# Altium project İHA-PDU.PrjPcb (part 1 of 13)
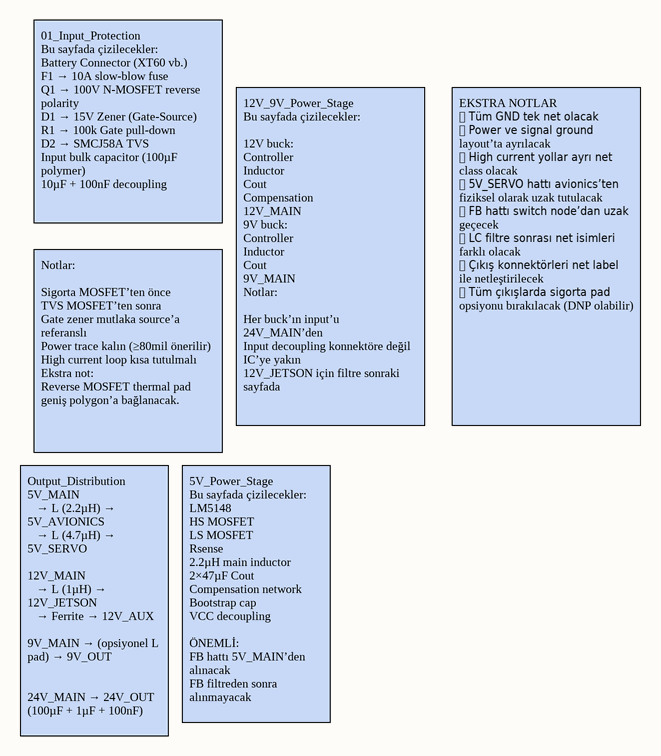
[diagram p0: PDU_Top_Level.SchDoc]
6 sheets, 163 parts. Net scope: global (net labels, ports and power ports of the same name join across sheets).
Board file: PDUNEW.PcbDoc
Sheets:
  PDU_Top_Level.SchDoc
  Input_Protection.SchDoc
  24V_Main_Regulator.SchDoc
  12V_9V_Power_Stage.SchDoc
  5V_Power_Stage.SchDoc
  Output_Distribution.SchDoc

## Sheet PDU_Top_Level.SchDoc
size 431 x 279 mm; Organization: ORGANIZATION; Address1: ADDRESS 1; Address2: ADDRESS 2; Address3: ADDRESS 3; Address4: ADDRESS 4; Revision: -; SheetNumber: 1; SheetTotal: 6; ENG_APP_DATE: --/--/--; DSN_APP_DATE: --/--/--; CHK_APP_DATE: --/--/--

### Notes on the sheet
- 01_Input_Protection
  Bu sayfada çizilecekler:
  Battery Connector (XT60 vb.)
  F1 → 10A slow-blow fuse
  Q1 → 100V N‑MOSFET reverse polarity
  D1 → 15V Zener (Gate‑Source)
  R1 → 100k Gate pull‑down
  D2 → SMCJ58A TVS
  Input bulk capacitor (100µF polymer)
  10µF + 100nF decoupling
- 12V_9V_Power_Stage
  Bu sayfada çizilecekler:
  12V buck:
  Controller
  Inductor
  Cout
  Compensation
  12V_MAIN
  9V buck:
  Controller
  Inductor
  Cout
  9V_MAIN
  Notlar:
  Her buck’ın input’u 24V_MAIN’den
  Input decoupling konnektöre değil IC’ye yakın
  12V_JETSON için filtre sonraki sayfada
- EKSTRA NOTLAR
  ✅ Tüm GND tek net olacak
  ✅ Power ve signal ground layout’ta ayrılacak
  ✅ High current yollar ayrı net class olacak
  ✅ 5V_SERVO hattı avionics’ten fiziksel olarak uzak tutulacak
  ✅ FB hattı switch node’dan uzak geçecek
  ✅ LC filtre sonrası net isimleri farklı olacak
  ✅ Çıkış konnektörleri net label ile netleştirilecek
  ✅ Tüm çıkışlarda sigorta pad opsiyonu bırakılacak (DNP olabilir)
- Notlar:
  Sigorta MOSFET’ten önce
  TVS MOSFET’ten sonra
  Gate zener mutlaka source’a referanslı
  Power trace kalın (≥80mil önerilir)
  High current loop kısa tutulmalı
  Ekstra not:
  Reverse MOSFET thermal pad geniş polygon’a bağlanacak.
- Output_Distribution
  5V_MAIN
  → L (2.2µH) → 5V_AVIONICS
  → L (4.7µH) → 5V_SERVO
  12V_MAIN
  → L (1µH) → 12V_JETSON
  → Ferrite → 12V_AUX
  9V_MAIN → (opsiyonel L pad) → 9V_OUT
  24V_MAIN → 24V_OUT
  (100µF + 1µF + 100nF)
- 5V_Power_Stage
  Bu sayfada çizilecekler:
  LM5148
  HS MOSFET
  LS MOSFET
  Rsense
  2.2µH main inductor
  2×47µF Cout
  Compensation network
  Bootstrap cap
  VCC decoupling
  ÖNEMLİ:
  FB hattı 5V_MAIN’den alınacak
  FB filtreden sonra alınmayacak
- DWG. NO.
- REV.
- SHT.
- THIS DOCUMENT AND THE DATA DISCLOSED HEREIN OR HEREWITH IS THE PROPERTY OF ALTIUM LIMITED AND MAY BE FREELY DISTRIBUTED IN WHOLE. NO RIGHTS ARE RESERVED OR EXPRESS OR IMPLIED WARANTEE GIVEN.
- REVISION
- DESCRIPTION
- DATE
- APPROVED
- ENG:
- APPROVALS
- PROJECT
- DSN:
- CHK:
- REFERENCE DOCUMENTS
- PROJECT REVISION:
- TITLE
- DOCUMENT REVISION:
- DESIGN ITEM:
- BOM:
- FAB DWG:
- PCB DWG:
- ASSY DWG:
- SCALE:
- SIZE
- B
- CAGE CODE
- FILE NAME
- DWG NO.
- SHEET
- OF
- REV

## Sheet Input_Protection.SchDoc
size 431 x 279 mm; Organization: ORGANIZATION; Address1: ADDRESS 1; Address2: ADDRESS 2; Address3: ADDRESS 3; Address4: ADDRESS 4; Revision: -; SheetNumber: 2; SheetTotal: 6; ENG_APP_DATE: --/--/--; DSN_APP_DATE: --/--/--; CHK_APP_DATE: --/--/--
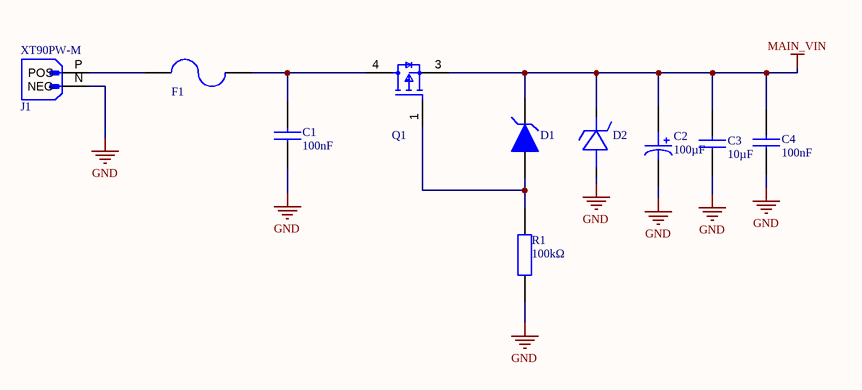
[diagram p1: Input_Protection.SchDoc]

### Parts
C1  value 100nF  [CAP_0603]  (hidden comment: CGA3E2X7R1H104K080AA)
C2  value 100µF  [CAP ALUM SMD]  (hidden comment: EEH-ZA1V101P)
C3  value 10µF  [CAP_1206]  (hidden comment: C3216X7R1H106K160AC)
C4  value 100nF  [CAP_0603]  (hidden comment: CGA3E2X7R1H104K080AA)
D1  BZT52C15  [SOD323]  (value not drawn)
D2  SMCJ58A  [SMC (DO-214AB)]  (value not drawn)
F1  Littelfuse 0452010.MRL  [FUSE_2410]  (value not drawn)
J1  XT90PW-M  [XT90PW-M]
Q1  SQM120P06-07L  [D2PAK]  (value not drawn)
R1  value 100kΩ  [RES_0603]  (hidden comment: CRCW0603100KFKEA)

### Nets
GND: C1.1 C2.2(A) C3.1 C4.1 D2.2 J1.N(NEG) R1.1
MAIN_VIN: C2.1(C) C3.2 C4.2 D1.1 D2.1 Q1.3(S)
NetC1_2: C1.2 F1.2 Q1.4(D)
NetD1_2: D1.2 Q1.1(G) R1.2
NetF1_1: F1.1 J1.P(POS)

### Notes on the sheet
- DWG. NO.
- REV.
- SHT.
- THIS DOCUMENT AND THE DATA DISCLOSED HEREIN OR HEREWITH IS THE PROPERTY OF ALTIUM LIMITED AND MAY BE FREELY DISTRIBUTED IN WHOLE. NO RIGHTS ARE RESERVED OR EXPRESS OR IMPLIED WARANTEE GIVEN.
- REVISION
- DESCRIPTION
- DATE
- APPROVED
- ENG:
- APPROVALS
- PROJECT
- DSN:
- CHK:
- REFERENCE DOCUMENTS
- PROJECT REVISION:
- TITLE
- DOCUMENT REVISION:
- DESIGN ITEM:
- BOM:
- FAB DWG:
- PCB DWG:
- ASSY DWG:
- SCALE:
- SIZE
- B
- CAGE CODE
- FILE NAME
- DWG NO.
- SHEET
- OF
- REV

### Library data of the parts
C1 C4 = CGA3E2X7R1H104K080AA: CGA Series 0603 100 nF 50 V ±10 % Tolerance X7R SMT Multilayer Ceramic Capacitor; Manufacturer: TDK; Manufacturer Lifecycle Status: PRODUCTION; Tolerance: 10%; Voltage: 50V; Supplier: Farnell; Supplier Part Number: CGA3E2X7R1H104K080AA; Manufacturer Part Number: CGA3E2X7R1H104K080AA; RoHS: Compliant; Category: Ceramic Capacitors; Stock: 155038; Pricing: 10=0,0336, 100=0,0286, 500=0,0215, 1000=0,0184, 2000=0,0173 (EUR); Case/Package: 0603; Case Code (Imperial): 0603; Case Code (Metric): 1608; China RoHS: Compliant; Composition: Ceramic; Depth: 800µm; Dielectric: X7R; Dielectric Material: Ceramic; Height: 800µm; Lead Free: Lead Free; Length: 1.6mm; Lifecycle Status: Production; Material: Ceramic; Max Length: 1.7mm; Max Operating Temperature: 125°C; Max Width: 900µm; Min Length: 1.5mm; Min Operating Temperature: -55°C; Min Width: 700µm; Mounting Technology: Surface Mount; Number of Terminals: 2; Radiation Hardening: No; Ratings: AEC-Q200; REACH SVHC: Yes; Schedule B: 8532240020, 8532240020|8532240020|8532240020|8532240020|8532240020; Termination: SMD/SMT; Thickness: 889µm; Voltage Rating: 50V; Voltage Rating (DC): 50V; Weight: 2.012816mg; Width: 800µm; ComponentLink1URL: https://datasheet.octopart.com:443/CGA3E2X7R1H104K080AA-TDK-datasheet-165583812.pdf?src-supplier=IHS; ComponentLink1Description: https://datasheet.octopart.com:443/CGA3E2X7R1H104K080AA-TDK-datasheet-165583812.pdf?src-supplier=IHS; ComponentLink2URL: https://datasheet.octopart.com:443/CGA3E2X7R1H104K080AA-TDK-datasheet-138890726.pdf?src-supplier=Upverter; ComponentLink2Description: https://datasheet.octopart.com:443/CGA3E2X7R1H104K080AA-TDK-datasheet-138890726.pdf?src-supplier=Upverter; ComponentLink3URL: https://datasheet.octopart.com:443/CGA3E2X7R1H104K080AA-TDK-datasheet-43457115.pdf?src-supplier=Upverter; ComponentLink3Description: https://datasheet.octopart.com:443/CGA3E2X7R1H104K080AA-TDK-datasheet-43457115.pdf?src-supplier=Upverter; ComponentLink4URL: https://datasheet.octopart.com:443/CGA3E2X7R1H104K080AA-TDK-datasheet-151546526.pdf?src-supplier=ODG+(Origin+Data+Global); ComponentLink4Description: https://datasheet.octopart.com:443/CGA3E2X7R1H104K080AA-TDK-datasheet-151546526.pdf?src-supplier=ODG+(Origin+Data+Global); ComponentLink5URL: https://datasheet.octopart.com:443/CGA3E2X7R1H104K080AA-TDK-datasheet-43366117.pdf?src-supplier=Newark; ComponentLink5Description: https://datasheet.octopart.com:443/CGA3E2X7R1H104K080AA-TDK-datasheet-43366117.pdf?src-supplier=Newark; ComponentLink6URL: https://datasheet.octopart.com:443/CGA3E2X7R1H104K080AA-TDK-datasheet-23766614.pdf?src-supplier=Newark; ComponentLink6Description: https://datasheet.octopart.com:443/CGA3E2X7R1H104K080AA-TDK-datasheet-23766614.pdf?src-supplier=Newark; ComponentLink7URL: https://datasheet.octopart.com:443/CGA3E2X7R1H104K080AA-TDK-datasheet-13444418.pdf?src-supplier=Newark; ComponentLink7Description: https://datasheet.octopart.com:443/CGA3E2X7R1H104K080AA-TDK-datasheet-13444418.pdf?src-supplier=Newark; ComponentLink8URL: https://datasheet.octopart.com:443/CGA3E2X7R1H104K080AA.-TDK-datasheet-159510193.pdf?src-supplier=Newark; ComponentLink8Description: https://datasheet.octopart.com:443/CGA3E2X7R1H104K080AA.-TDK-datasheet-159510193.pdf?src-supplier=Newark; ComponentLink9URL: https://datasheet.octopart.com:443/CGA3E2X7R1H104K080AA-TDK-datasheet-136412745.pdf?src-supplier=element14+APAC; ComponentLink9Description: https://datasheet.octopart.com:443/CGA3E2X7R1H104K080AA-TDK-datasheet-136412745.pdf?src-supplier=element14+APAC; ComponentLink10URL: https://datasheet.octopart.com:443/CGA3E2X7R1H104K080AA-TDK-datasheet-21217900.pdf?src-supplier=Farnell; ComponentLink10Description: https://datasheet.octopart.com:443/CGA3E2X7R1H104K080AA-TDK-datasheet-21217900.pdf?src-supplier=Farnell; ComponentLink11URL: https://datasheet.octopart.com:443/CGA3E2X7R1H104K080AA-TDK-datasheet-164882302.pdf?src-supplier=Burklin+Elektronik; ComponentLink11Description: https://datasheet.octopart.com:443/CGA3E2X7R1H104K080AA-TDK-datasheet-164882302.pdf?src-supplier=Burklin+Elektronik; ComponentLink12URL: https://datasheet.octopart.com:443/CGA3E2X7R1H104K080AA-TDK-datasheet-13234200.pdf?src-supplier=Future+Electronics; ComponentLink12Description: https://datasheet.octopart.com:443/CGA3E2X7R1H104K080AA-TDK-datasheet-13234200.pdf?src-supplier=Future+Electronics; ComponentLink13URL: https://datasheet.octopart.com:443/CGA3E2X7R1H104K080AA-TDK-datasheet-12527010.pdf?src-supplier=Future+Electronics; ComponentLink13Description: https://datasheet.octopart.com:443/CGA3E2X7R1H104K080AA-TDK-datasheet-12527010.pdf?src-supplier=Future+Electronics; ComponentLink14URL: https://datasheet.octopart.com:443/CGA3E2X7R1H104K080AA-TDK-datasheet-140571036.pdf?src-supplier=Arrow.cn; ComponentLink14Description: https://datasheet.octopart.com:443/CGA3E2X7R1H104K080AA-TDK-datasheet-140571036.pdf?src-supplier=Arrow.cn
C2 = EEH-ZA1V101P: Conductive Polymer Hybrid Aluminum Electrolytic Capacitors, 100µF, 35V, -55 to 105¡C; Manufacturer: Panasonic; Manufacturer Lifecycle Status: ACTIVE; Part Series: ZA (High temp. reflow); ESR (Equivalent Series Resistance): 27mΩ; Leakage Current: 35µA; Life (Hours): 10000hours; Ripple Current: 2.3A; Tolerance: 20%; Supplier: Future Electronics; Supplier Part Number: EEH-ZA1V101P; Manufacturer Part Number: EEH-ZA1V101P; RoHS: Compliant; Category: Polymer Capacitors; Stock: 1000; Pricing: 500=0,335, 1000=0,33, 1500=0,325, 5000=0,315 (USD); ComponentLink1URL: https://datasheet.octopart.com:443/EEH-ZA1V101P-Panasonic-datasheet-136612405.pdf?src-supplier=Electro+Sonic; ComponentLink1Description: https://datasheet.octopart.com:443/EEH-ZA1V101P-Panasonic-datasheet-136612405.pdf?src-supplier=Electro+Sonic; ComponentLink2URL: https://datasheet.octopart.com:443/EEH-ZA1V101P-Panasonic-datasheet-154840537.pdf?src-supplier=Electro+Sonic; ComponentLink2Description: https://datasheet.octopart.com:443/EEH-ZA1V101P-Panasonic-datasheet-154840537.pdf?src-supplier=Electro+Sonic; ComponentLink3URL: https://datasheet.octopart.com:443/EEH-ZA1V101P-Panasonic-datasheet-68301292.pdf?src-supplier=Future+Electronics; ComponentLink3Description: https://datasheet.octopart.com:443/EEH-ZA1V101P-Panasonic-datasheet-68301292.pdf?src-supplier=Future+Electronics; Case/Package: 3333; Country of Origin: Japan; Diameter: 8mm; Export Control Classification Number (ECCN) Code: EAR99; Height: 10.2mm; Harmonized Tariff Schedule (HTS) Code: 8532.22.00.20; Introduction Date: 2019-05-31; Length: 10.2mm; Lifecycle Status: Production; Material: Polymer; Max Operating Temperature: 105°C; Min Operating Temperature: -55°C; Mounting Technology: Surface Mount; Number of Terminals: 2; Ratings: AEC-Q200; REACH SVHC: Yes; Voltage Rating: 35V; Voltage Rating (DC): 35V; Width: 8.3mm; ComponentLink4URL: https://datasheet.octopart.com:443/EEHZA1V101P-Panasonic-datasheet-68301292.pdf?src-supplier=Panasonic; ComponentLink4Description: https://datasheet.octopart.com:443/EEHZA1V101P-Panasonic-datasheet-68301292.pdf?src-supplier=Panasonic; ComponentLink5URL: https://datasheet.octopart.com:443/EEHZA1V101P-Panasonic-datasheet-137675046.pdf?src-supplier=TME; ComponentLink5Description: https://datasheet.octopart.com:443/EEHZA1V101P-Panasonic-datasheet-137675046.pdf?src-supplier=TME
C3 = C3216X7R1H106K160AC: 50V 10uF X7R 卤10% 1206 Multilayer Ceramic Capacitors MLCC - SMD/SMT ROHS; Manufacturer: TDK; Manufacturer Lifecycle Status: PRODUCTION; Supplier: Farnell; Supplier Part Number: C3216X7R1H106K160AC; Manufacturer Part Number: C3216X7R1H106K160AC; RoHS: Compliant; Category: Ceramic Capacitors; Stock: 6363; Pricing: 5=0,77, 50=0,378, 250=0,344, 500=0,286, 1000=0,268, 2000=0,259 (EUR); Case/Package: 1206; Case Code (Metric): 3216; China RoHS: Compliant; Dielectric: X7R; Dielectric Material: Ceramic; Export Control Classification Number (ECCN) Code: EAR99; Height: 1.6mm; Harmonized Tariff Schedule (HTS) Code: 8532.24.00.20; Introduction Date: 2018-03-29; Lead Free: Lead Free; Length: 3.2mm; Lifecycle Status: Production; Material: Ceramic; Max Length: 3.5mm; Max Operating Temperature: 125°C; Max Width: 1.9mm; Min Length: 3.1mm; Min Operating Temperature: -55°C; Min Width: 1.5mm; Mounting Technology: Surface Mount; Number of Terminals: 2; REACH SVHC: Yes; Schedule B: 8532240020, 8532240020|8532240020|8532240020|8532240020|8532240020; Thickness: 1.6mm; Voltage Rating: 50V; Voltage Rating (DC): 50V; Width: 1.6mm; ComponentLink1URL: https://datasheet.octopart.com:443/C3216X7R1H106K160AC-TDK-datasheet-175423548.pdf?src-supplier=TME; ComponentLink1Description: https://datasheet.octopart.com:443/C3216X7R1H106K160AC-TDK-datasheet-175423548.pdf?src-supplier=TME; ComponentLink2URL: https://datasheet.octopart.com:443/C3216X7R1H106K160AC-TDK-datasheet-182135025.pdf?src-supplier=TME; ComponentLink2Description: https://datasheet.octopart.com:443/C3216X7R1H106K160AC-TDK-datasheet-182135025.pdf?src-supplier=TME; ComponentLink3URL: https://datasheet.octopart.com:443/C3216X7R1H106K160AC-TDK-datasheet-159617022.pdf?src-supplier=TME; ComponentLink3Description: https://datasheet.octopart.com:443/C3216X7R1H106K160AC-TDK-datasheet-159617022.pdf?src-supplier=TME; ComponentLink4URL: https://datasheet.octopart.com:443/C3216X7R1H106K160AC-TDK-datasheet-151546523.pdf?src-supplier=ODG+(Origin+Data+Global); ComponentLink4Description: https://datasheet.octopart.com:443/C3216X7R1H106K160AC-TDK-datasheet-151546523.pdf?src-supplier=ODG+(Origin+Data+Global); ComponentLink5URL: https://datasheet.octopart.com/C3216X7R1H106K160AC-TDK-datasheet-41194876.pdf; ComponentLink5Description: https://datasheet.octopart.com/C3216X7R1H106K160AC-TDK-datasheet-41194876.pdf; ComponentLink6URL: https://datasheet.octopart.com/C-Series-Ceramic-Chip-Capacitors-TDK-datasheet-family-84.pdf; ComponentLink6Description: https://datasheet.octopart.com/C-Series-Ceramic-Chip-Capacitors-TDK-datasheet-family-84.pdf; ComponentLink7URL: http://sigma.octopart.com:80/rohs_certificate/C-Series-Ceramic-Chip-Capacitors-TDK-family-108.pdf?src-supplier=Compliance+Statements; ComponentLink7Description: http://sigma.octopart.com:80/rohs_certificate/C-Series-Ceramic-Chip-Capacitors-TDK-family-108.pdf?src-supplier=Compliance+Statements
D1 = BZT52C15: BZT52C15S Series 200 mW 15 V 10 mA Surface Mount Zener Diode - SOD-323; Manufacturer: Diodes Inc.; Manufacturer Part Number: BZT52C15S-7-F; Element Configuration: Single; ESD Protection: No; Forward Current: 10mA; Forward Voltage: 900mV; Impedance: 30Ω; Max Junction Temperature (Tj): 150°C; Max Power Dissipation: 200mW; Max Reverse Leakage Current: 100nA; Number of Elements: 1; Output Current: 50mA; Polarity: Unidirectional; Reference Voltage: 15V; Reverse Voltage: 10.5V; Test Current: 5mA; Tolerance: 6%; Voltage Tolerance: 6.12%; Supplier: Arrow Electronics; Supplier Part Number: BZT52C15S-7-F; RoHS: Compliant; Category: Zener Diodes; Stock: 448; Pricing: 448=0,0267 (USD); China RoHS: Compliant; Composition: Zener; Contact Plating: Tin; Country of Origin: Mainland China, Taiwan; Export Control Classification Number (ECCN) Code: EAR99; Height: 1.2mm; Harmonized Tariff Schedule (HTS) Code: 8541.10.00.50; Introduction Date: 2002-09-04; Lead Free: Lead Free; Length: 1.8mm; Lifecycle Status: Production; Max Operating Temperature: 150°C; Min Operating Temperature: -65°C; Mounting Technology: Surface Mount; Pins: 2; Number of Terminals: 2; Packaging: Cut Tape; Peak Reverse Current: 100nA; Power Dissipation: 200mW; Power Rating: 200mW; Radiation Hardening: No; REACH SVHC: Yes; Schedule B: 8541100050, 8541100050|8541100050|8541100050|8541100050|8541100050; Termination: SMD/SMT; Voltage Rating (DC): 15V; Weight: 4.904468mg; Width: 1.4mm; Working Voltage: 15V; Zener Current: 5mA; Zener Voltage: 15V; ComponentLink1URL: https://sigma.octopart.com:443/138810740/technical_drawing/Diodes-Inc.-BZT52C15S-7-F.pdf?src-supplier=Diodes+Inc+SCT; ComponentLink1Description: https://sigma.octopart.com:443/138810740/technical_drawing/Diodes-Inc.-BZT52C15S-7-F.pdf?src-supplier=Diodes+Inc+SCT; ComponentLink2URL: https://datasheet.octopart.com:443/BZT52C15S-7-F-Diodes-Inc.-datasheet-101585694.pdf?src-supplier=element14+APAC; ComponentLink2Description: https://datasheet.octopart.com:443/BZT52C15S-7-F-Diodes-Inc.-datasheet-101585694.pdf?src-supplier=element14+APAC; ComponentLink3URL: https://datasheet.octopart.com:443/BZT52C15S-7-F-Diodes-Inc.-datasheet-11024782.pdf?src-supplier=RS+(Formerly+Allied+Electronics); ComponentLink3Description: https://datasheet.octopart.com:443/BZT52C15S-7-F-Diodes-Inc.-datasheet-11024782.pdf?src-supplier=RS+(Formerly+Allied+Electronics); ComponentLink4URL: https://datasheet.octopart.com/BZT52C15S-7-F-Diodes-Inc.-datasheet-10841798.pdf; ComponentLink4Description: https://datasheet.octopart.com/BZT52C15S-7-F-Diodes-Inc.-datasheet-10841798.pdf; ComponentLink5URL: https://datasheet.octopart.com/BZT52C15S-7-F-Diodes-Inc.-datasheet-5391111.pdf; ComponentLink5Description: https://datasheet.octopart.com/BZT52C15S-7-F-Diodes-Inc.-datasheet-5391111.pdf; ComponentLink6URL: https://datasheet.octopart.com:443/BZT52C15S-7-F-Diodes-Inc.-datasheet-101585693.pdf?src-supplier=Future+Electronics; ComponentLink6Description: https://datasheet.octopart.com:443/BZT52C15S-7-F-Diodes-Inc.-datasheet-101585693.pdf?src-supplier=Future+Electronics; ComponentLink7URL: https://datasheet.octopart.com:443/BZT52C15S-7-F-Diodes-Inc.-datasheet-12513818.pdf?src-supplier=Future+Electronics; ComponentLink7Description: https://datasheet.octopart.com:443/BZT52C15S-7-F-Diodes-Inc.-datasheet-12513818.pdf?src-supplier=Future+Electronics; ComponentLink8URL: https://datasheet.octopart.com:443/BZT52C15S-7-F-Diodes-Inc.-datasheet-10941054.pdf?src-supplier=Future+Electronics; ComponentLink8Description: https://datasheet.octopart.com:443/BZT52C15S-7-F-Diodes-Inc.-datasheet-10941054.pdf?src-supplier=Future+Electronics; ComponentLink9URL: https://datasheet.octopart.com:443/BZT52C15S-7-F-Diodes-Inc.-datasheet-10839781.pdf?src-supplier=Future+Electronics; ComponentLink9Description: https://datasheet.octopart.com:443/BZT52C15S-7-F-Diodes-Inc.-datasheet-10839781.pdf?src-supplier=Future+Electronics; ComponentLink10URL: https://datasheet.octopart.com:443/BZT52C15S-7-F-Diodes-Inc.-datasheet-10405015.pdf?src-supplier=Future+Electronics; ComponentLink10Description: https://datasheet.octopart.com:443/BZT52C15S-7-F-Diodes-Inc.-datasheet-10405015.pdf?src-supplier=Future+Electronics; ComponentLink11URL: https://datasheet.octopart.com:443/BZT52C15S-7-F-Diodes-Inc.-datasheet-5318325.pdf?src-supplier=Future+Electronics; ComponentLink11Description: https://datasheet.octopart.com:443/BZT52C15S-7-F-Diodes-Inc.-datasheet-5318325.pdf?src-supplier=Future+Electronics; ComponentLink12URL: https://datasheet.octopart.com:443/BZT52C15S-7-F-Diodes-Inc.-datasheet-14050910.pdf?src-supplier=iiiC; ComponentLink12Description: https://datasheet.octopart.com:443/BZT52C15S-7-F-Diodes-Inc.-datasheet-14050910.pdf?src-supplier=iiiC; ComponentLink13URL: https://datasheet.octopart.com:443/BZT52C15S-7-F-Diodes-Inc.-datasheet-120913.pdf?src-supplier=DigiKey; ComponentLink13Description: https://datasheet.octopart.com:443/BZT52C15S-7-F-Diodes-Inc.-datasheet-120913.pdf?src-supplier=DigiKey; ComponentLink14URL: https://datasheet.octopart.com:443/BZT52C15S-7-F-Diodes-Inc.-datasheet-1309.pdf?src-supplier=Mouser; ComponentLink14Description: https://datasheet.octopart.com:443/BZT52C15S-7-F-Diodes-Inc.-datasheet-1309.pdf?src-supplier=Mouser; ComponentLink15URL: http://sigma.octopart.com:80/15616907/materials_sheet/Diodes-Inc.-BZT52C15S-7-F.pdf?src-supplier=Compliance+Statements; ComponentLink15Description: http://sigma.octopart.com:80/15616907/materials_sheet/Diodes-Inc.-BZT52C15S-7-F.pdf?src-supplier=Compliance+Statements
D2 = SMCJ58A: Diode TVS Single Uni-Directional 58V 1.5kW 2-Pin DO-214AB; Manufacturer: Taiwan Semiconductor; Manufacturer Lifecycle Status: ACTIVE; Breakdown Voltage: 67.8V; Clamping Voltage: 93.6V; Forward Voltage: 1V; Max Breakdown Voltage: 71.2V; Max Forward Surge Current (Ifsm): 2.5A; Max Junction Temperature (Tj): 150°C; Max Power Dissipation: 5W; Max Repetitive Reverse Voltage (Vrrm): 250V; Max Reverse Leakage Current: 1µA; Max Surge Current: 200A; Min Breakdown Voltage: 64.4V; Number of Channels: 1; Peak Pulse Current: 16A; Polarity: Unidirectional; Power Dissipation: 200mW; Reverse Recovery Time: 50ns; Supplier: Farnell; Supplier Part Number: SMCJ58A; Manufacturer Part Number: SMCJ58A; RoHS: Compliant; Category: TVS Diodes; Stock: 274; Pricing: 1=0,594, 10=0,49, 100=0,342, 500=0,331, 1000=0,32, 5000=0,309 (EUR); China RoHS: Non-Compliant; Country of Origin: Mainland China, Taiwan; Export Control Classification Number (ECCN) Code: EAR99; Height: 2.62mm; Harmonized Tariff Schedule (HTS) Code: 8541.10.00.50; Introduction Date: 1998-01-21; Lead Free: Lead Free; Length: 7.11mm; Lifecycle Status: Production; Max Operating Temperature: 150°C; Min Operating Temperature: -55°C; Number of Elements: 1; Pins: 2; Number of Terminals: 2; Operating Supply Voltage: 58V; Peak Pulse Power: 1.5kW; Power Rating: 1.5kW; REACH SVHC: No; Reverse Standoff Voltage: 58V; Schedule B: 8541100080; Voltage Rating (DC): 58V; Width: 6.22mm; ComponentLink1URL: https://datasheet.octopart.com:443/SMCJ58A-Taiwan-Semiconductor-datasheet-151942226.pdf?src-supplier=TME; ComponentLink1Description: https://datasheet.octopart.com:443/SMCJ58A-Taiwan-Semiconductor-datasheet-151942226.pdf?src-supplier=TME; ComponentLink2URL: https://datasheet.octopart.com:443/SMCJ58A-Taiwan-Semiconductor-datasheet-181551142.pdf?src-supplier=IHS; ComponentLink2Description: https://datasheet.octopart.com:443/SMCJ58A-Taiwan-Semiconductor-datasheet-181551142.pdf?src-supplier=IHS; ComponentLink3URL: https://datasheet.octopart.com:443/SMCJ58A-Taiwan-Semiconductor-datasheet-182396156.pdf?src-supplier=IHS; ComponentLink3Description: https://datasheet.octopart.com:443/SMCJ58A-Taiwan-Semiconductor-datasheet-182396156.pdf?src-supplier=IHS; ComponentLink4URL: https://datasheet.octopart.com:443/SMCJ58A-Taiwan-Semiconductor-datasheet-180789152.pdf?src-supplier=IHS; ComponentLink4Description: https://datasheet.octopart.com:443/SMCJ58A-Taiwan-Semiconductor-datasheet-180789152.pdf?src-supplier=IHS; ComponentLink5URL: https://datasheet.octopart.com:443/SMCJ58A-Taiwan-Semiconductor-datasheet-137249697.pdf?src-supplier=Taiwan+Semiconductor; ComponentLink5Description: https://datasheet.octopart.com:443/SMCJ58A-Taiwan-Semiconductor-datasheet-137249697.pdf?src-supplier=Taiwan+Semiconductor; ComponentLink6URL: https://datasheet.octopart.com:443/SMCJ58A-Taiwan-Semiconductor-datasheet-34355355.pdf?src-supplier=Taiwan+Semiconductor; ComponentLink6Description: https://datasheet.octopart.com:443/SMCJ58A-Taiwan-Semiconductor-datasheet-34355355.pdf?src-supplier=Taiwan+Semiconductor; ComponentLink7URL: https://datasheet.octopart.com:443/SMCJ58A-Taiwan-Semiconductor-datasheet-65933527.pdf?src-supplier=Future+Electronics; ComponentLink7Description: https://datasheet.octopart.com:443/SMCJ58A-Taiwan-Semiconductor-datasheet-65933527.pdf?src-supplier=Future+Electronics
F1 = Littelfuse 0452010.MRL: Electric Fuse, Time Lag Blow, 10A, 72VAC, 60VDC, 50A (IR), Surface Mount, NANO; Ratings: CE, CSA, TUV; Time to Trip: 2ms; Voltage Rating (AC): 72V; Voltage Rating (DC): 60V; Supplier: Farnell; Supplier Part Number: 0452010.MRL; Manufacturer: Littelfuse; Manufacturer Part Number: 0452010.MRL; RoHS: Compliant; Category: Fuses; Stock: 195; Pricing: 1=3,24, 50=2,06, 100=1,9, 250=1,71, 500=1,57, 1000=1,46 (EUR); Current Rating: 10A; Export Control Classification Number (ECCN) Code: EAR99; Height: 2.69mm; Harmonized Tariff Schedule (HTS) Code: 8536.10.00.40; Introduction Date: 2024-06-26; Length: 6.1mm; Lifecycle Status: Production; Max Operating Temperature: 125°C; Min Operating Temperature: -55°C; Mounting Technology: Surface Mount; REACH SVHC: No; ComponentLink1URL: https://datasheet.octopart.com:443/0452010.MRL-Littelfuse-datasheet-183575671.pdf?src-supplier=Sager+Electronics; ComponentLink1Description: https://datasheet.octopart.com:443/0452010.MRL-Littelfuse-datasheet-183575671.pdf?src-supplier=Sager+Electronics
J1 = XT90PW-M: Socket; DC supply; XT90; male; PIN: 2; on PCBs; THT; Colour: yellow; Manufacturer: Amass; Category: Uncategorized; Color: Yellow; Contact Material: Brass; Manufacturer Part Number: XT90PW-M; Pins: 2; Orientation: Straight
Q1 = SQM120P06-07L: MOSFET P-CH 60V 120A TO263 / Trans MOSFET P-CH 60V 120A Automotive 3-Pin(2+Tab) D2PAK; Manufacturer: Vishay; Manufacturer Part Number: SQM120P06-07L_GE3; Drain to Source Breakdown Voltage: -60V; Drain to Source Resistance: 6.7mΩ; Element Configuration: Single; Fall Time: 32ns; Gate to Source Voltage (Vgs): 20V; Input Capacitance: 14.28nF; Max Junction Temperature (Tj): 175°C; Max Power Dissipation: 375W; Number of Channels: 1; Rise Time: 23ns; Threshold Voltage: -2V; Turn-Off Delay Time: 97ns; Turn-On Delay Time: 15ns; Supplier: Farnell; Supplier Part Number: SQM120P06-07L_GE3; RoHS: Compliant; Category: MOSFETs; Stock: 2376; Pricing: 1=4,9, 10=3,2, 100=2,51, 500=2,1, 1000=2,06 (EUR); Case/Package: TO-263; Continuous Drain Current (ID): 120A; Drain to Source Voltage (Vdss): -60V; Export Control Classification Number (ECCN) Code: EAR99; Height: 5.08mm; Introduction Date: 2010-09-09; Lead Free: Lead Free; Lifecycle Status: Production; Max Operating Temperature: 175°C; Min Breakdown Voltage: 60V; Min Operating Temperature: -55°C; Mounting Technology: Surface Mount; Number of Elements: 1; Pins: 3; Number of Terminals: 2; Packaging: Tape & Reel; Power Dissipation: 375W; Radiation Hardening: No; Rds On Max: 6.7mΩ; REACH SVHC: No; Schedule B: 8541290080, 8541290080|8541290080|8541290080|8541290080|8541290080; Weight: 1.946308g; ComponentLink1URL: https://datasheet.octopart.com:443/SQM120P06-07L_GE3-Vishay-datasheet-181368167.pdf?src-supplier=IHS; ComponentLink1Description: https://datasheet.octopart.com:443/SQM120P06-07L_GE3-Vishay-datasheet-181368167.pdf?src-supplier=IHS; ComponentLink2URL: https://datasheet.octopart.com:443/SQM120P06-07L_GE3-Vishay-datasheet-58971610.pdf?src-supplier=Upverter; ComponentLink2Description: https://datasheet.octopart.com:443/SQM120P06-07L_GE3-Vishay-datasheet-58971610.pdf?src-supplier=Upverter; ComponentLink3URL: https://datasheet.octopart.com:443/SQM120P06-07L_GE3-Vishay-datasheet-66078331.pdf?src-supplier=Newark; ComponentLink3Description: https://datasheet.octopart.com:443/SQM120P06-07L_GE3-Vishay-datasheet-66078331.pdf?src-supplier=Newark; ComponentLink4URL: https://datasheet.octopart.com:443/SQM120P06-07L_GE3-Vishay-datasheet-182431440.pdf?src-supplier=Future+Electronics; ComponentLink4Description: https://datasheet.octopart.com:443/SQM120P06-07L_GE3-Vishay-datasheet-182431440.pdf?src-supplier=Future+Electronics; ComponentLink5URL: http://sigma.octopart.com:80/rohs_statement/Vishay-company-15.pdf?src-supplier=Compliance+Statements; ComponentLink5Description: http://sigma.octopart.com:80/rohs_statement/Vishay-company-15.pdf?src-supplier=Compliance+Statements
R1 = CRCW0603100KFKEA: Res Thick Film 0603 100K Ohm 1% 1/3W ±100ppm/°C Molded SMD SMD Paper T/R; Manufacturer: Vishay; Manufacturer Part Number: CRCW0603100KFKEAHP; Max Power Dissipation: 250mW; Power Rating: 330mW; Voltage Rating: 75V; Supplier: Farnell; Supplier Part Number: CRCW0603100KFKEAHP; RoHS: Compliant; Category: Chip SMD Resistors; Stock: 78590; Pricing: 10=0,0404, 100=0,0303, 500=0,0261, 1000=0,0239, 2500=0,0223, 5000=0,0219 (EUR); Case/Package: 0603; Case Code (Imperial): 0603; Case Code (Metric): 1608; China RoHS: Non-Compliant; Composition: Thick Film; Contact Plating: Tin; Country of Origin: Israel; Depth: 850µm; Export Control Classification Number (ECCN) Code: EAR99; Features: Automotive AEC-Q200; Height: 450µm; Harmonized Tariff Schedule (HTS) Code: 8533.21.00.30; Introduction Date: 2008-07-29; Lead Free: Lead Free; Length: 1.6mm; Lifecycle Status: Production; Max Operating Temperature: 155°C; Military Standard: Not; Min Operating Temperature: -55°C; Mounting Technology: Surface Mount; Pins: 2; Number of Terminals: 2; Number of Terminations: 2; Packaging: Cut Tape; Radiation Hardening: No; Ratings: AEC-Q200; REACH SVHC: Yes; Schedule B: 8533210045, 8533210045|8533210045|8533210045|8533210045|8533210045; Temperature Coefficient: 100ppm/°C; Termination: SMD/SMT; Tolerance: 1%; Voltage Rating (DC): 75V; Weight: 2.012816mg; Width: 850µm; Working Voltage: 75V; ComponentLink1URL: https://datasheet.octopart.com:443/CRCW0603100KFKEAHP-Vishay-datasheet-13148866.pdf?src-supplier=Future+Electronics; ComponentLink1Description: https://datasheet.octopart.com:443/CRCW0603100KFKEAHP-Vishay-datasheet-13148866.pdf?src-supplier=Future+Electronics; ComponentLink2URL: https://datasheet.octopart.com:443/CRCW0603100KFKEAHP-Vishay-datasheet-13131392.pdf?src-supplier=Future+Electronics; ComponentLink2Description: https://datasheet.octopart.com:443/CRCW0603100KFKEAHP-Vishay-datasheet-13131392.pdf?src-supplier=Future+Electronics; ComponentLink3URL: https://datasheet.octopart.com:443/CRCW0603100KFKEAHP-Vishay-datasheet-12593106.pdf?src-supplier=Future+Electronics; ComponentLink3Description: https://datasheet.octopart.com:443/CRCW0603100KFKEAHP-Vishay-datasheet-12593106.pdf?src-supplier=Future+Electronics; ComponentLink4URL: https://datasheet.octopart.com:443/CRCW0603100KFKEAHP-Vishay-datasheet-12531795.pdf?src-supplier=Future+Electronics; ComponentLink4Description: https://datasheet.octopart.com:443/CRCW0603100KFKEAHP-Vishay-datasheet-12531795.pdf?src-supplier=Future+Electronics; ComponentLink5URL: https://datasheet.octopart.com:443/CRCW0603100KFKEAHP-Vishay-datasheet-12518686.pdf?src-supplier=Future+Electronics; ComponentLink5Description: https://datasheet.octopart.com:443/CRCW0603100KFKEAHP-Vishay-datasheet-12518686.pdf?src-supplier=Future+Electronics; ComponentLink6URL: https://datasheet.octopart.com:443/CRCW0603100KFKEAHP-Vishay-datasheet-12509906.pdf?src-supplier=Future+Electronics; ComponentLink6Description: https://datasheet.octopart.com:443/CRCW0603100KFKEAHP-Vishay-datasheet-12509906.pdf?src-supplier=Future+Electronics; ComponentLink7URL: https://datasheet.octopart.com:443/CRCW0603100KFKEAHP-Vishay-datasheet-10669844.pdf?src-supplier=Future+Electronics; ComponentLink7Description: https://datasheet.octopart.com:443/CRCW0603100KFKEAHP-Vishay-datasheet-10669844.pdf?src-supplier=Future+Electronics; ComponentLink8URL: https://datasheet.octopart.com:443/CRCW0603100KFKEAHP-Vishay-datasheet-8703221.pdf?src-supplier=Future+Electronics; ComponentLink8Description: https://datasheet.octopart.com:443/CRCW0603100KFKEAHP-Vishay-datasheet-8703221.pdf?src-supplier=Future+Electronics; ComponentLink9URL: https://datasheet.octopart.com:443/CRCW0603100KFKEAHP-Vishay-datasheet-62316122.pdf?src-supplier=Future+Electronics; ComponentLink9Description: https://datasheet.octopart.com:443/CRCW0603100KFKEAHP-Vishay-datasheet-62316122.pdf?src-supplier=Future+Electronics; ComponentLink10URL: https://datasheet.octopart.com:443/CRCW0603100KFKEAHP-Vishay-datasheet-12544674.pdf?src-supplier=_legacy+Avnet; ComponentLink10Description: https://datasheet.octopart.com:443/CRCW0603100KFKEAHP-Vishay-datasheet-12544674.pdf?src-supplier=_legacy+Avnet; ComponentLink11URL: https://datasheet.octopart.com:443/CRCW0603100KFKEAHP-Vishay-datasheet-87136057.pdf?src-supplier=Newark; ComponentLink11Description: https://datasheet.octopart.com:443/CRCW0603100KFKEAHP-Vishay-datasheet-87136057.pdf?src-supplier=Newark; ComponentLink12URL: https://datasheet.octopart.com:443/CRCW0603100KFKEAHP-Vishay-datasheet-66581887.pdf?src-supplier=Newark; ComponentLink12Description: https://datasheet.octopart.com:443/CRCW0603100KFKEAHP-Vishay-datasheet-66581887.pdf?src-supplier=Newark; ComponentLink13URL: https://datasheet.octopart.com:443/CRCW0603100KFKEAHP-Vishay-datasheet-37143532.pdf?src-supplier=Newark; ComponentLink13Description: https://datasheet.octopart.com:443/CRCW0603100KFKEAHP-Vishay-datasheet-37143532.pdf?src-supplier=Newark; ComponentLink14URL: https://datasheet.octopart.com:443/CRCW0603100KFKEAHP-Vishay-datasheet-8359436.pdf?src-supplier=Newark; ComponentLink14Description: https://datasheet.octopart.com:443/CRCW0603100KFKEAHP-Vishay-datasheet-8359436.pdf?src-supplier=Newark; ComponentLink15URL: https://datasheet.octopart.com:443/CRCW0603100KFKEAHP-Vishay-datasheet-112276998.pdf?src-supplier=Newark; ComponentLink15Description: https://datasheet.octopart.com:443/CRCW0603100KFKEAHP-Vishay-datasheet-112276998.pdf?src-supplier=Newark; ComponentLink16URL: https://datasheet.octopart.com:443/CRCW0603100KFKEAHP-Vishay-datasheet-62317933.pdf?src-supplier=element14+APAC; ComponentLink16Description: https://datasheet.octopart.com:443/CRCW0603100KFKEAHP-Vishay-datasheet-62317933.pdf?src-supplier=element14+APAC; ComponentLink17URL: https://datasheet.octopart.com/CRCW0603100KFKEAHP-Vishay-datasheet-83567917.pdf; ComponentLink17Description: https://datasheet.octopart.com/CRCW0603100KFKEAHP-Vishay-datasheet-83567917.pdf; ComponentLink18URL: https://datasheet.octopart.com/D-CRCW-e3-Standard-Thick-Film-Chip-Resistors-Vishay-datasheet-family-64.pdf; ComponentLink18Description: https://datasheet.octopart.com/D-CRCW-e3-Standard-Thick-Film-Chip-Resistors-Vishay-datasheet-family-64.pdf; ComponentLink19URL: https://datasheet.octopart.com:443/CRCW0603100KFKEAHP-Vishay-Dale-datasheet-47688881.pdf?src-supplier=RS+(Formerly+Allied+Electronics); ComponentLink19Description: https://datasheet.octopart.com:443/CRCW0603100KFKEAHP-Vishay-Dale-datasheet-47688881.pdf?src-supplier=RS+(Formerly+Allied+Electronics); ComponentLink20URL: http://sigma.octopart.com:80/rohs_certificate/D-CRCW-e3-Standard-Thick-Film-Chip-Resistors-Vishay-family-102.pdf?src-supplier=Compliance+Statements; ComponentLink20Description: http://sigma.octopart.com:80/rohs_certificate/D-CRCW-e3-Standard-Thick-Film-Chip-Resistors-Vishay-family-102.pdf?src-supplier=Compliance+Statements

## Sheet 24V_Main_Regulator.SchDoc
size 431 x 279 mm; Organization: ORGANIZATION; Address1: ADDRESS 1; Address2: ADDRESS 2; Address3: ADDRESS 3; Address4: ADDRESS 4; Revision: -; SheetNumber: 3; SheetTotal: 6; ENG_APP_DATE: --/--/--; DSN_APP_DATE: --/--/--; CHK_APP_DATE: --/--/--
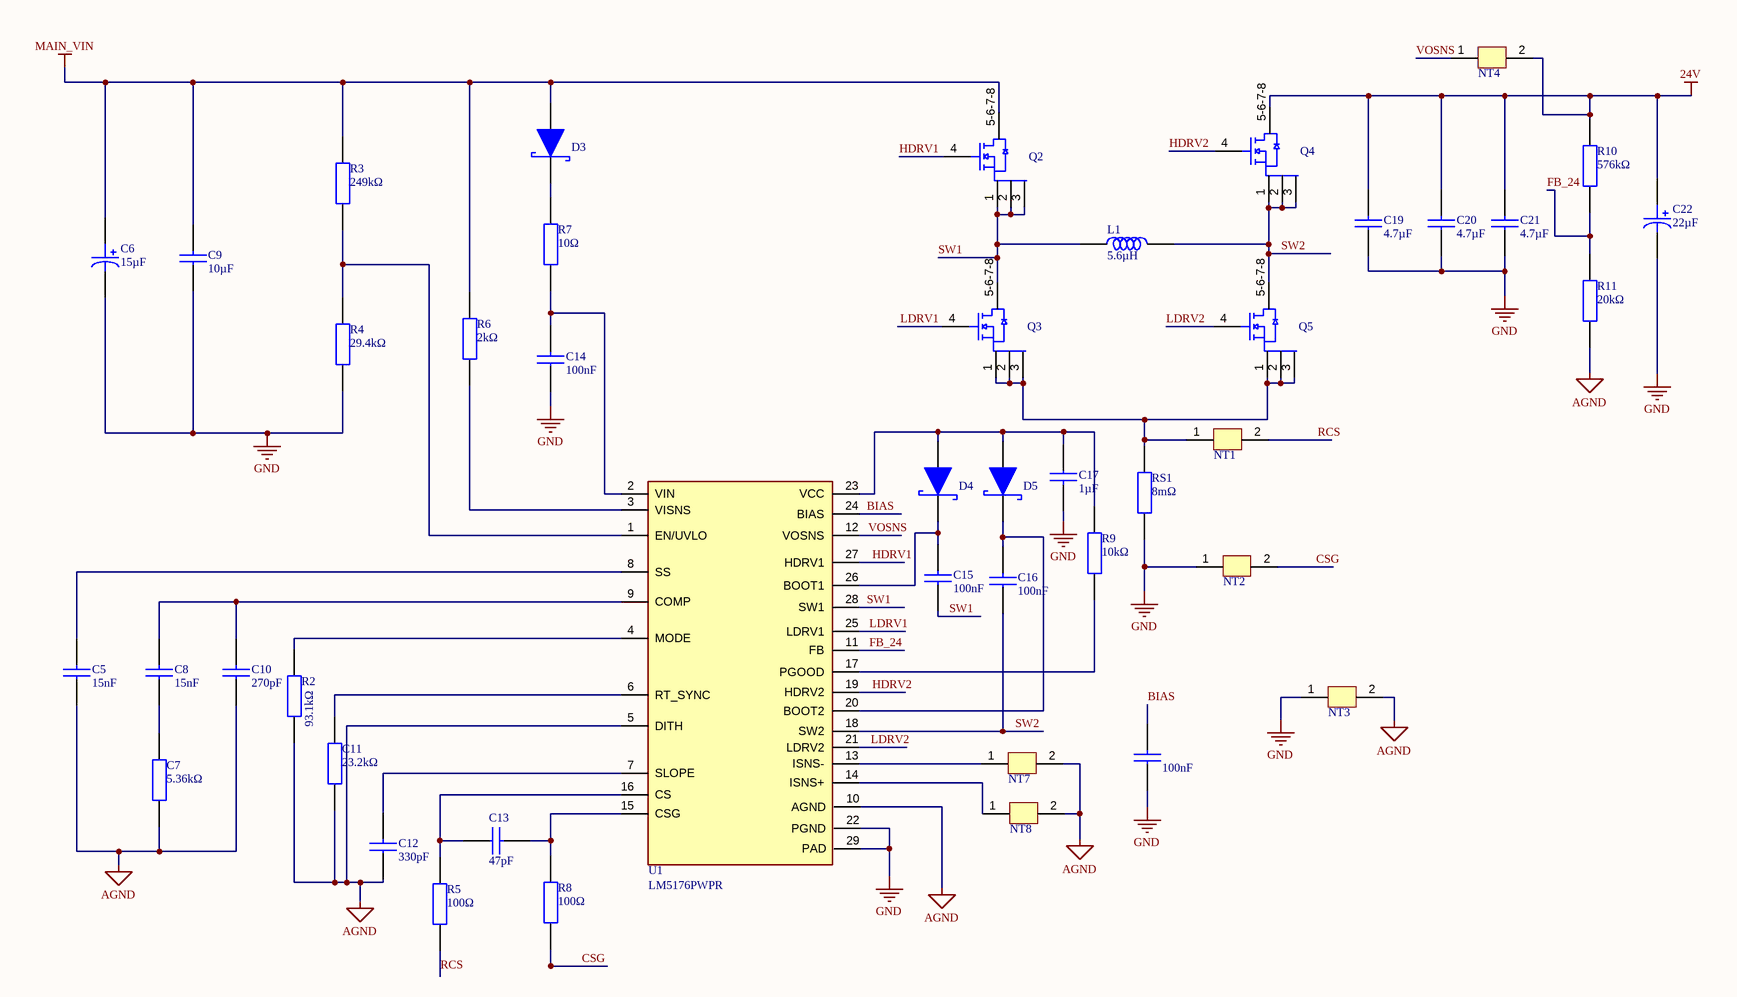
[diagram p2: 24V_Main_Regulator.SchDoc]

### Parts
C5  value 15nF  [CAP_0603]  (hidden comment: C0603C153J3GACTU)
C6  value 15µF  [CAP ALUM SMD]  (hidden comment: 100SXV15M)
C7  value 5.36kΩ  [RES_0402]  (hidden comment: CRCW04025K36FKED)
C8  value 15nF  [CAP_0402]  (hidden comment: CGA2B3X7R1H153K050BB)
C9  value 10µF  [CAP_2220]  (hidden comment: C5750X7S2A106M230KB)
C10  value 270pF  [CAP_0805]  (hidden comment: CL21C271JBANNNC)
C11  value 23.2kΩ  [RES_0402]  (hidden comment: CRCW040223K2FKED)
C12  value 330pF  [CAP_0603]  (hidden comment: CL10C331JB8NNNC)
C13  value 47pF  [CAP_0603]  (hidden comment: 06035A470JAT2A)
C14  value 100nF  [CAP_0603]  (hidden comment: CC0603KRX7R9BB104)
C15  value 100nF  [CAP_0603]  (hidden comment: 06033C104KAT2A)
C16  value 100nF  [CAP_0603]  (hidden comment: 06033C104KAT2A)
C17  value 1µF  [CAP_0603]  (hidden comment: EMK107B7105KA-T)
C18  value 100nF  [CAP_0805]  (hidden comment: C0805C104M5RACTU)
C19  value 4.7µF  [CAP_0805]  (hidden comment: MSASU21GBB5475KTNA01)
C20  value 4.7µF  [CAP_0805]  (hidden comment: MSASU21GBB5475KTNA01)
C21  value 4.7µF  [CAP_0805]  (hidden comment: MSASU21GBB5475KTNA01)
C22  value 22µF  [CAP ALUM SMD]  (hidden comment: 35SVPF22M)
D3  SS110  [SS110]  (value not drawn)
D4  SS110  [SS110]  (value not drawn)
D5  SS110  [SS110]  (value not drawn)
L1  value 5.6µH  [XAL1010]  (hidden comment: XAL1010-562MEB)
NT1  Net-Tie  [Net-Tie]  (value not drawn)  (net tie, no BOM)
NT2  Net-Tie  [Net-Tie]  (value not drawn)  (net tie, no BOM)
NT3  Net-Tie  [Net-Tie]  (value not drawn)  (net tie, no BOM)
NT4  Net-Tie  [Net-Tie]  (value not drawn)  (net tie, no BOM)
NT7  Net-Tie  [Net-Tie]  (value not drawn)  (net tie, no BOM)
NT8  Net-Tie  [Net-Tie]  (value not drawn)  (net tie, no BOM)
Q2  CSD19534Q5A  [SON 5X6]  (value not drawn)
Q3  CSD19534Q5A  [SON 5X6]  (value not drawn)
Q4  CSD18540Q5B  [SON 5X6]  (value not drawn)
Q5  CSD18531Q5A  [SON 5X6]  (value not drawn)
R2  value 93.1kΩ  [RES_0603]  (hidden comment: RC0603FR-0793K1L)
R3  value 249kΩ  [RES_0402]  (hidden comment: CRCW0402249KFKED)
R4  value 29.4kΩ  [RES_0402]  (hidden comment: CRCW040229K4FKED)
R5  value 100Ω  [RES_0603]  (hidden comment: CRCW0603100RFKEA)
R6  value 2kΩ  [RES_0603]  (hidden comment: CRCW06032K00FKEA)
R7  value 10Ω  [RES_0603]  (hidden comment: RC0603FR-0710RL)
R8  value 100Ω  [RES_0603]  (hidden comment: CRCW0603100RFKEA)
R9  value 10kΩ  [RES_0603]  (hidden comment: RC0603FR-0710KL)
R10  value 576kΩ  [RES_0603]  (hidden comment: RC0603FR-07576KL)
R11  value 20kΩ  [RES_0603]  (hidden comment: RC0603FR-0720KL)
RS1  value 8mΩ  [RES_2512]  (hidden comment: PMR100HZPFU8L00)
U1  LM5176PWPR  [28-HTSSOP]

### Nets
24V: C19.2 C20.2 C21.2 C22.1(C) NT4.2 Q4.5-6-7-8(D) R10.2
AGND: C5.1 C7.1 C10.1 C11.1 C12.1 NT3.2 NT7.2 NT8.2 R2.1 R11.1 U1.5(DITH) U1.10(AGND)
GND: C6.2(A) C9.1 C14.1 C17.2 C18.1 C19.1 C20.1 C21.1 C22.2(A) NT2.1 NT3.1 R4.1 RS1.1 U1.22(PGND) U1.29(PAD)
MAIN_VIN: C6.1(C) C9.2 D3.2(Anode) Q2.5-6-7-8(D) R3.2 R6.2
BIAS: C18.2 U1.24(BIAS)
CSG: NT2.2 R8.1
FB_24: R10.1 R11.2 U1.11(FB)
HDRV1: Q2.4(G) U1.27(HDRV1)
HDRV2: Q4.4(G) U1.19(HDRV2)
LDRV1: Q3.4(G) U1.25(LDRV1)
LDRV2: Q5.4(G) U1.21(LDRV2)
RCS: NT1.2 R5.1
SW1: C15.1 L1.1 Q2.1(S) Q2.2(S) Q2.3(S) Q3.5-6-7-8(D) U1.28(SW1)
SW2: C16.1 L1.2 Q4.1(S) Q4.2(S) Q4.3(S) Q5.5-6-7-8(D) U1.18(SW2)
VOSNS: NT4.1 U1.12(VOSNS)
NetC5_2: C5.2 U1.8(SS)
NetC7_2: C7.2 C8.1
NetC8_2: C8.2 C10.2 U1.9(COMP)
NetC11_2: C11.2 U1.6(RT_SYNC)
NetC12_2: C12.2 U1.7(SLOPE)
NetC13_1: C13.1 R5.2 U1.16(CS)
NetC13_2: C13.2 R8.2 U1.15(CSG)
NetC14_2: C14.2 R7.1 U1.2(VIN)
NetC15_2: C15.2 D4.1(Cathode) U1.26(BOOT1)
NetC16_2: C16.2 D5.1(Cathode) U1.20(BOOT2)
NetC17_1: C17.1 D4.2(Anode) D5.2(Anode) R9.2 U1.23(VCC)
NetD3_1: D3.1(Cathode) R7.2
NetNT1_1: NT1.1 Q3.1(S) Q3.2(S) Q3.3(S) Q5.1(S) Q5.2(S) Q5.3(S) RS1.2
NetNT7_1: NT7.1 U1.13(ISNS-)
NetNT8_1: NT8.1 U1.14(ISNS+)
NetR2_2: R2.2 U1.4(MODE)
NetR3_1: R3.1 R4.2 U1.1(EN/UVLO)
NetR6_1: R6.1 U1.3(VISNS)
NetR9_1: R9.1 U1.17(PGOOD)

### Notes on the sheet
- DWG. NO.
- REV.
- SHT.
- THIS DOCUMENT AND THE DATA DISCLOSED HEREIN OR HEREWITH IS THE PROPERTY OF ALTIUM LIMITED AND MAY BE FREELY DISTRIBUTED IN WHOLE. NO RIGHTS ARE RESERVED OR EXPRESS OR IMPLIED WARANTEE GIVEN.
- REVISION
- DESCRIPTION
- DATE
- APPROVED
- ENG:
- APPROVALS
- PROJECT
- DSN:
- CHK:
- REFERENCE DOCUMENTS
- PROJECT REVISION:
- TITLE
- DOCUMENT REVISION:
- DESIGN ITEM:
- BOM:
- FAB DWG:
- PCB DWG:
- ASSY DWG:
- SCALE:
- SIZE
- B
- CAGE CODE
- FILE NAME
- DWG NO.
- SHEET
- OF
- REV